# Altium schematic sheet HC_OUTPUTS.SchDoc
size A
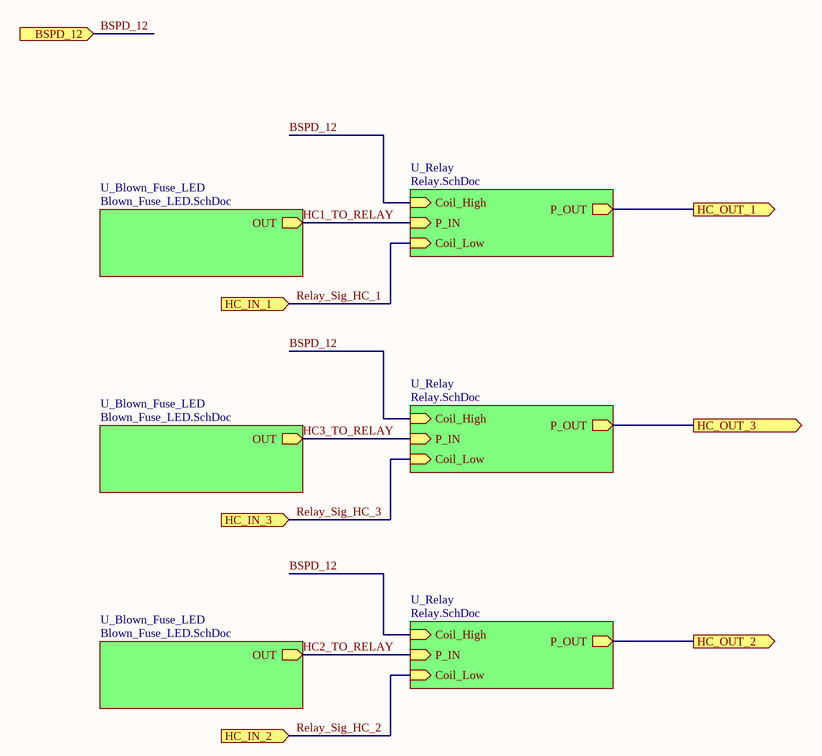
[diagram p0: HC_OUTPUTS.SchDoc]

## Sub-sheets
U_Blown_Fuse_LED = Blown_Fuse_LED.SchDoc: OUT (out)
U_Blown_Fuse_LED = Blown_Fuse_LED.SchDoc: OUT (out)
U_Blown_Fuse_LED = Blown_Fuse_LED.SchDoc: OUT (out)
U_Relay = Relay.SchDoc: P_OUT (out), P_IN (in), Coil_High (in), Coil_Low (in)
U_Relay = Relay.SchDoc: P_OUT (out), P_IN (in), Coil_High (in), Coil_Low (in)
U_Relay = Relay.SchDoc: P_OUT (out), P_IN (in), Coil_High (in), Coil_Low (in)

## Ports
BSPD_12 (in), HC_IN_1 (in), HC_IN_2 (in), HC_IN_3 (in), HC_OUT_1 (out), HC_OUT_2 (out), HC_OUT_3 (out)

## Nets
BSPD_12: port BSPD_12, sheet U_Relay/Coil_High, sheet U_Relay/Coil_High, sheet U_Relay/Coil_High
HC1_TO_RELAY: sheet U_Blown_Fuse_LED/OUT, sheet U_Relay/P_IN
HC2_TO_RELAY: sheet U_Blown_Fuse_LED/OUT, sheet U_Relay/P_IN
HC3_TO_RELAY: sheet U_Blown_Fuse_LED/OUT, sheet U_Relay/P_IN
HC_OUT_1: port HC_OUT_1, sheet U_Relay/P_OUT
HC_OUT_2: port HC_OUT_2, sheet U_Relay/P_OUT
HC_OUT_3: port HC_OUT_3, sheet U_Relay/P_OUT
Relay_Sig_HC_1: port HC_IN_1, sheet U_Relay/Coil_Low
Relay_Sig_HC_2: port HC_IN_2, sheet U_Relay/Coil_Low
Relay_Sig_HC_3: port HC_IN_3, sheet U_Relay/Coil_Low